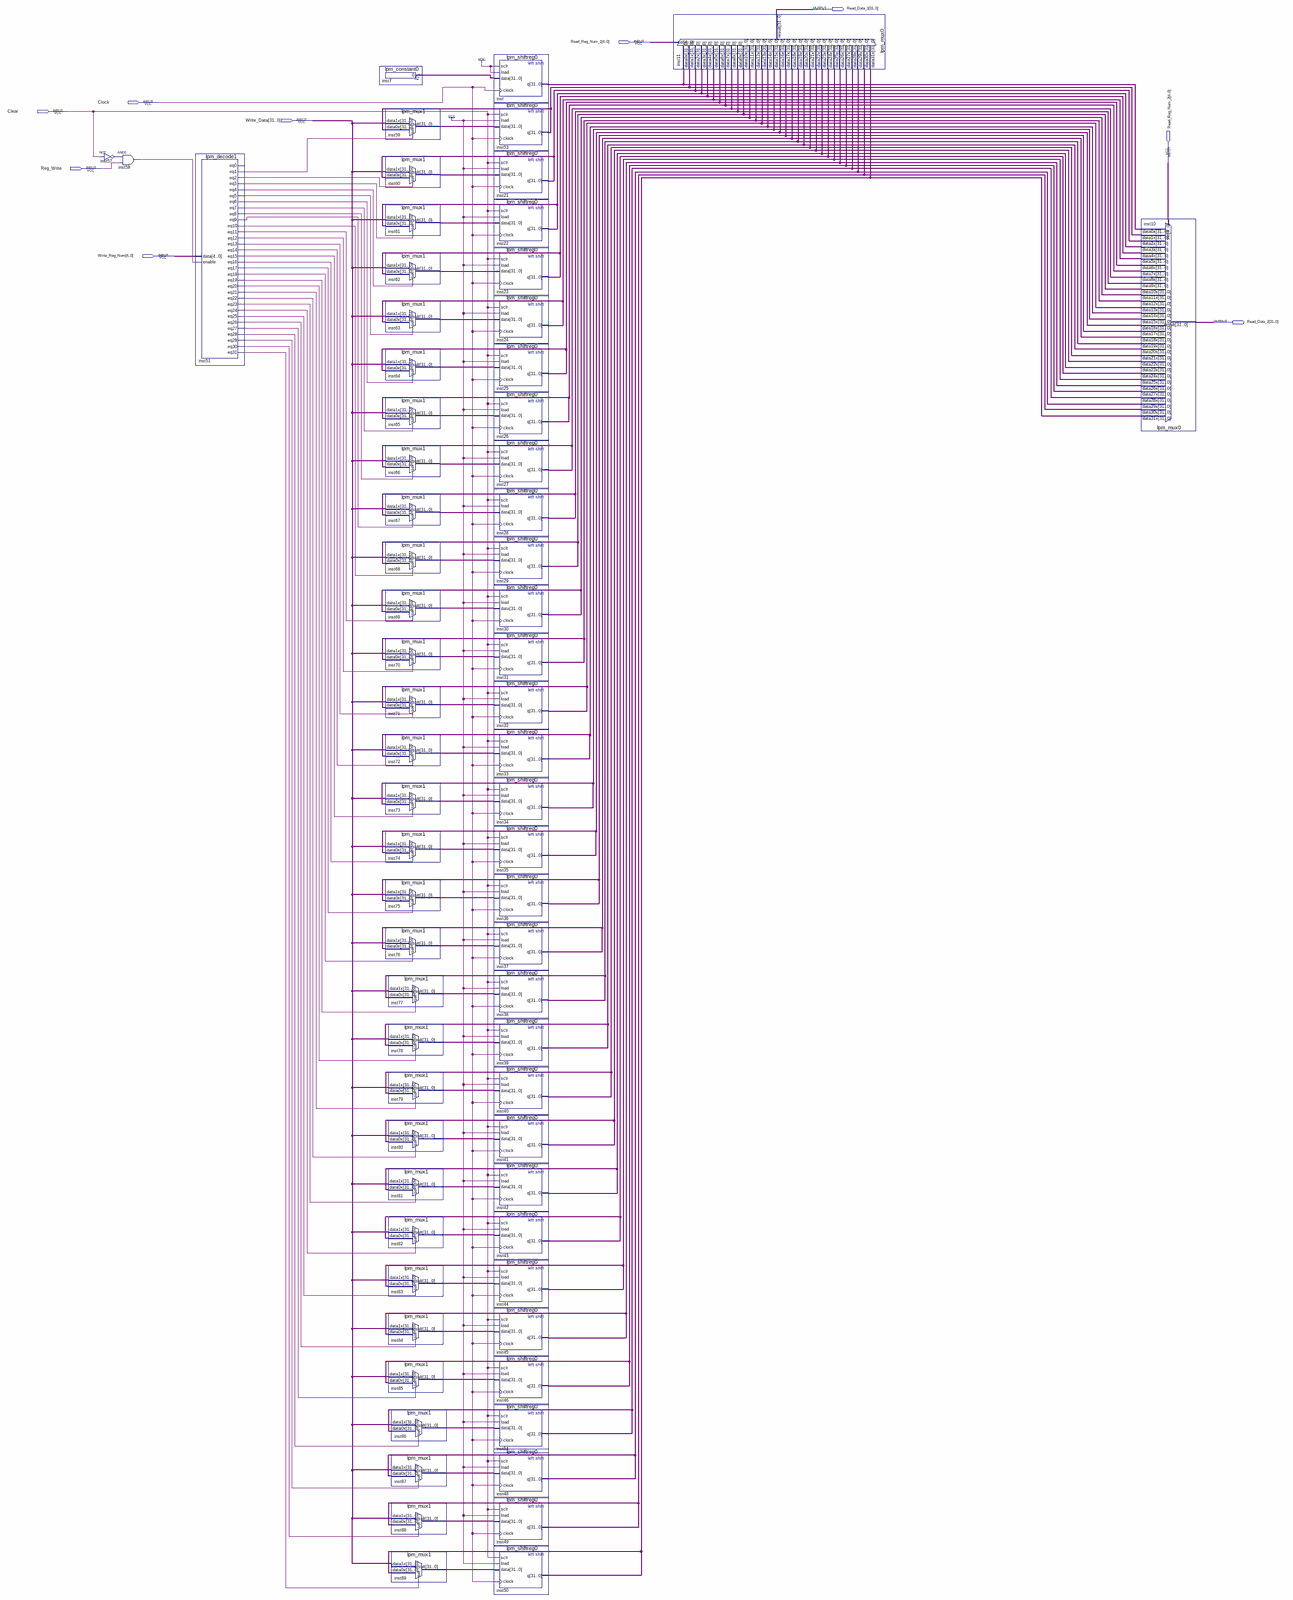
[diagram p0: schematic sheet, whole]
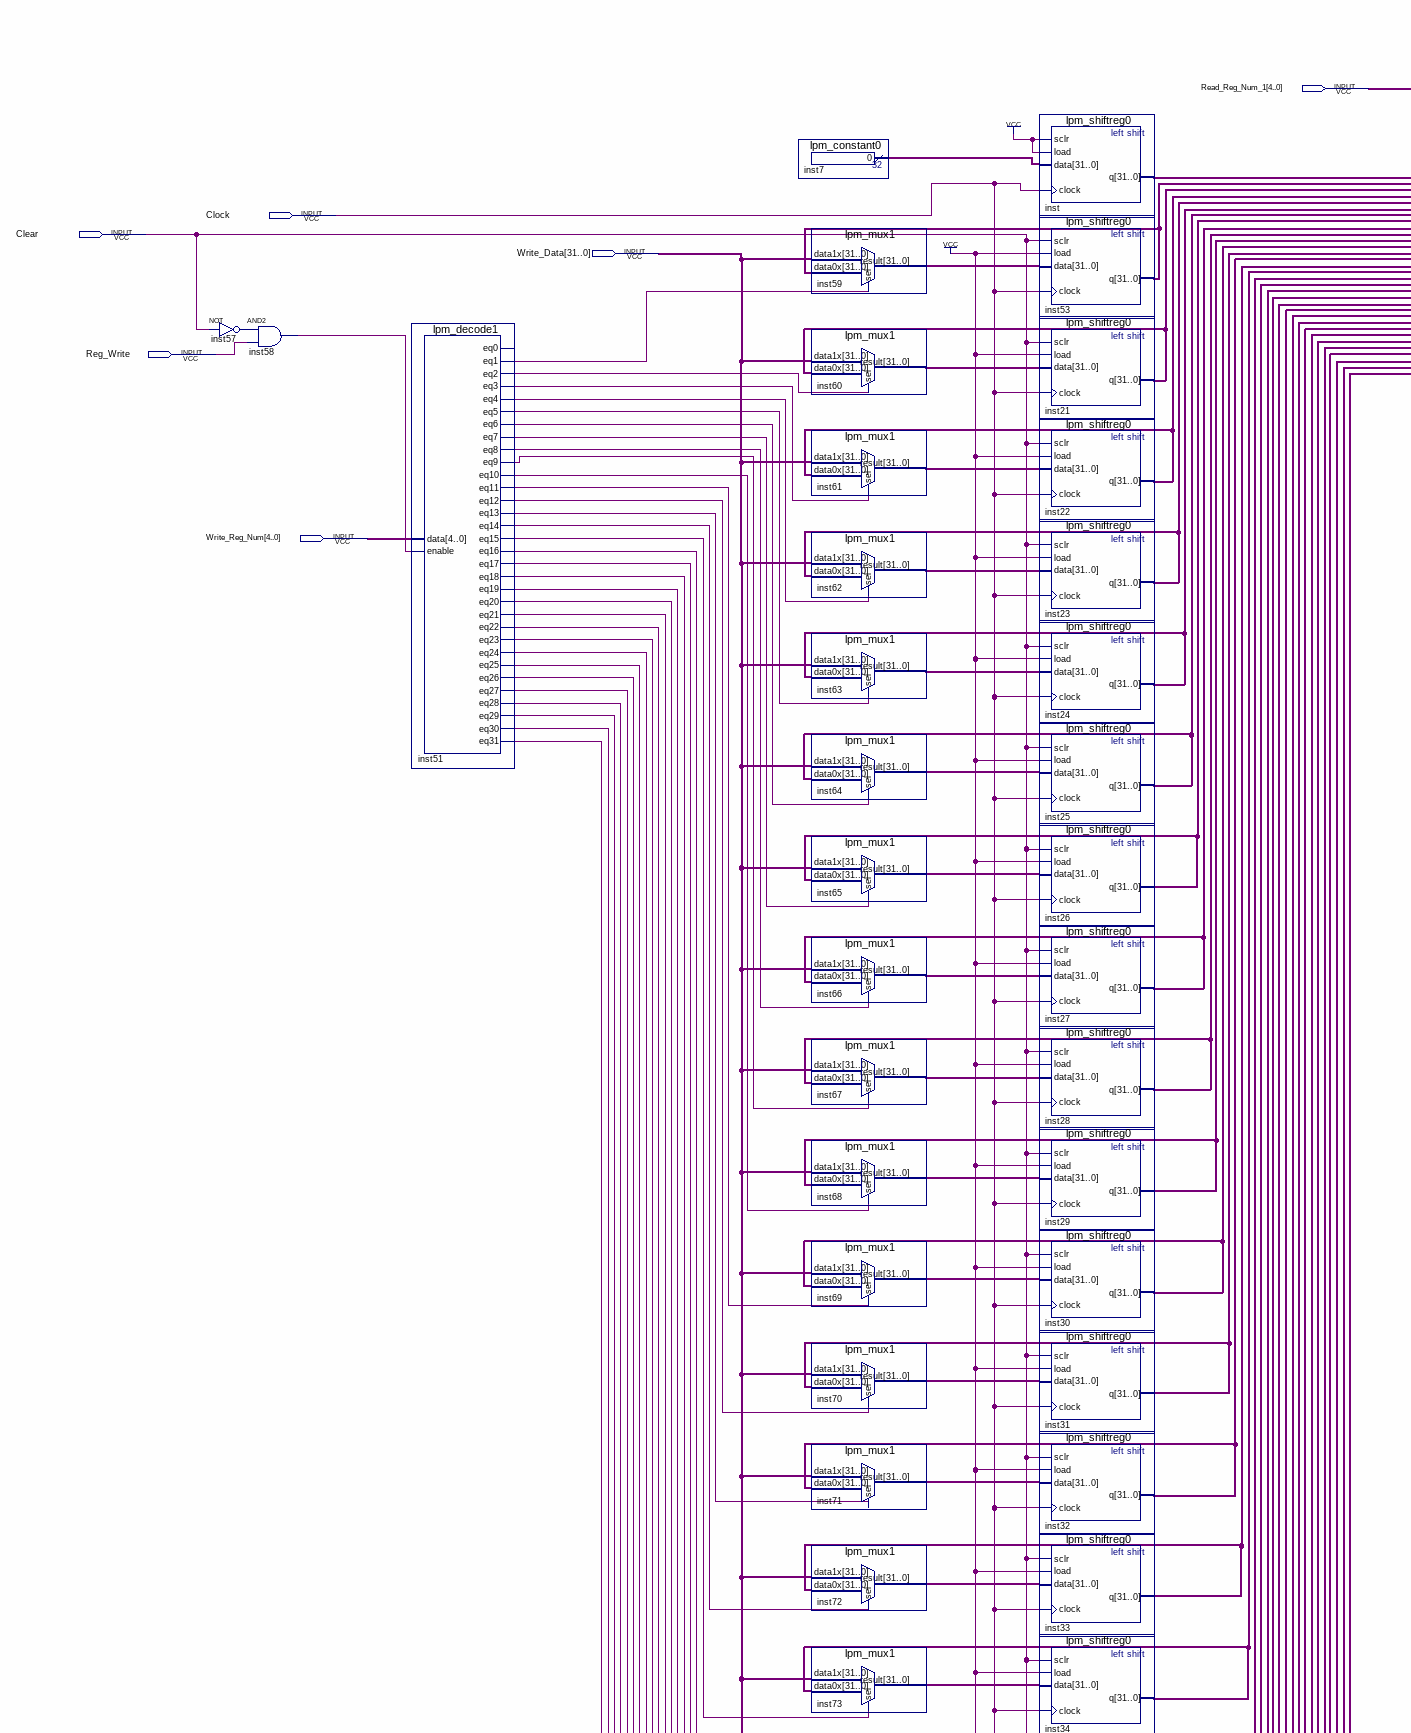
[diagram p1: schematic sheet, upper left part]
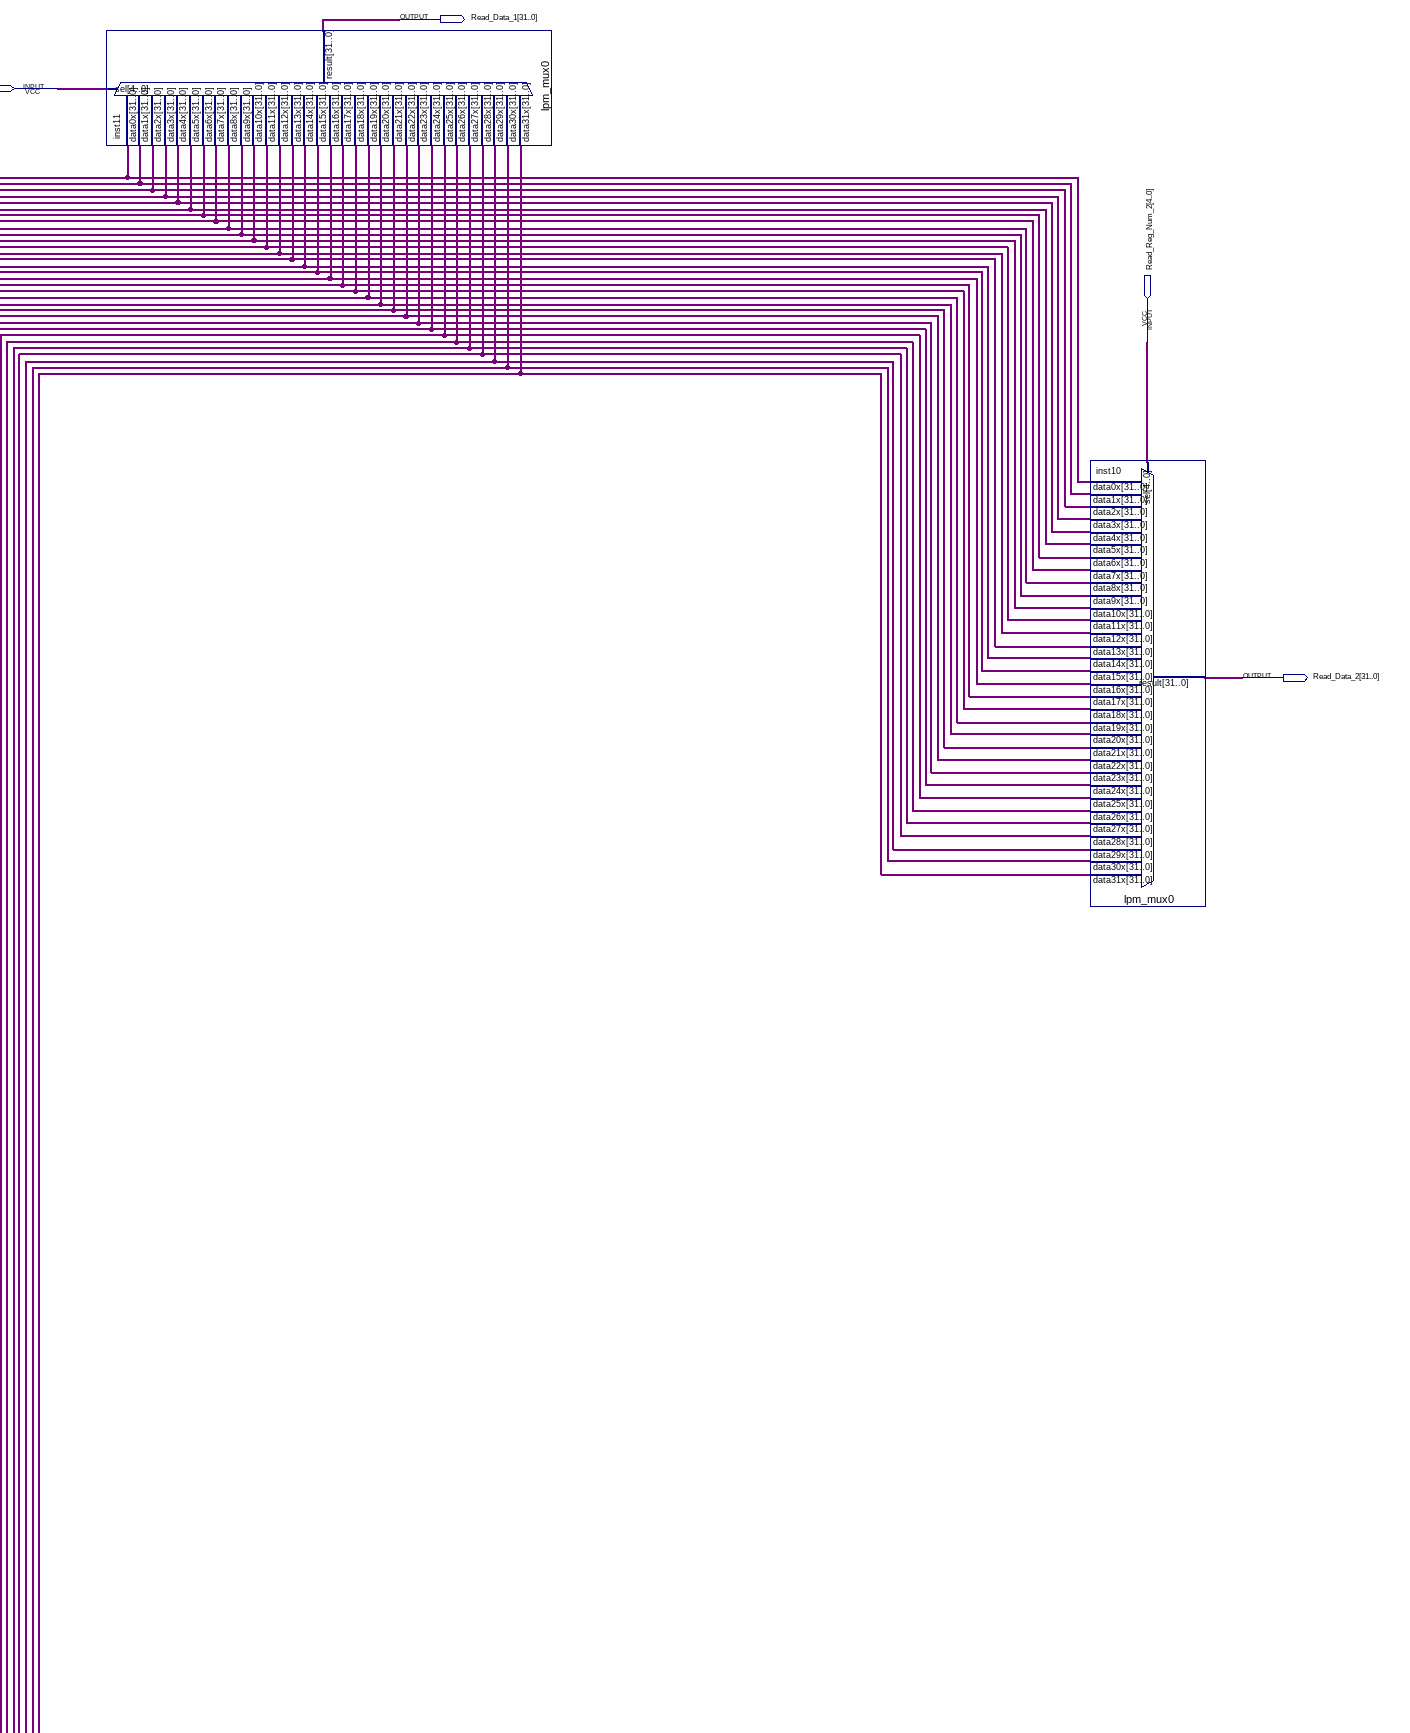
[diagram p2: schematic sheet, upper right part]
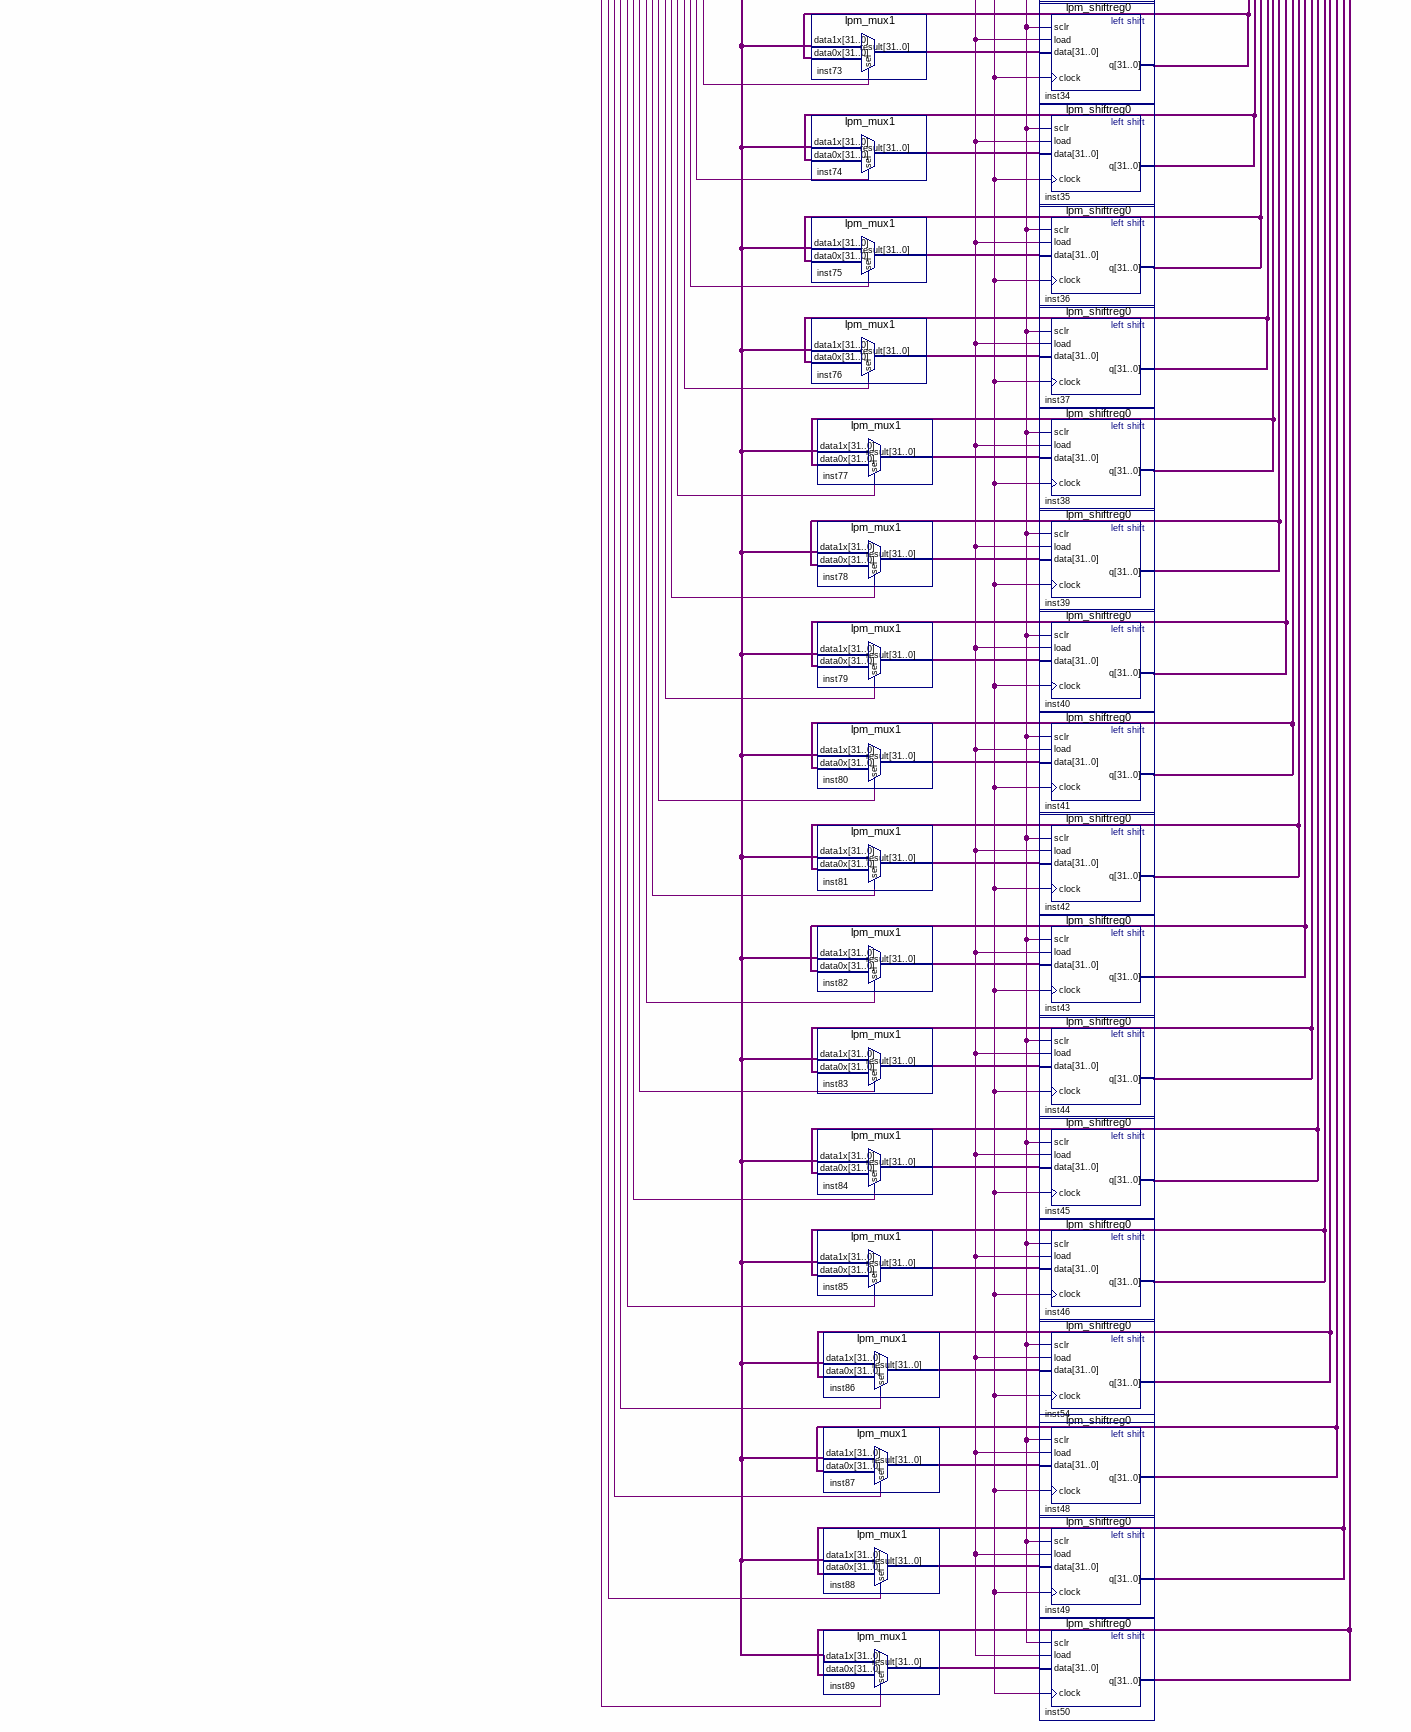
[diagram p3: schematic sheet, lower left part]
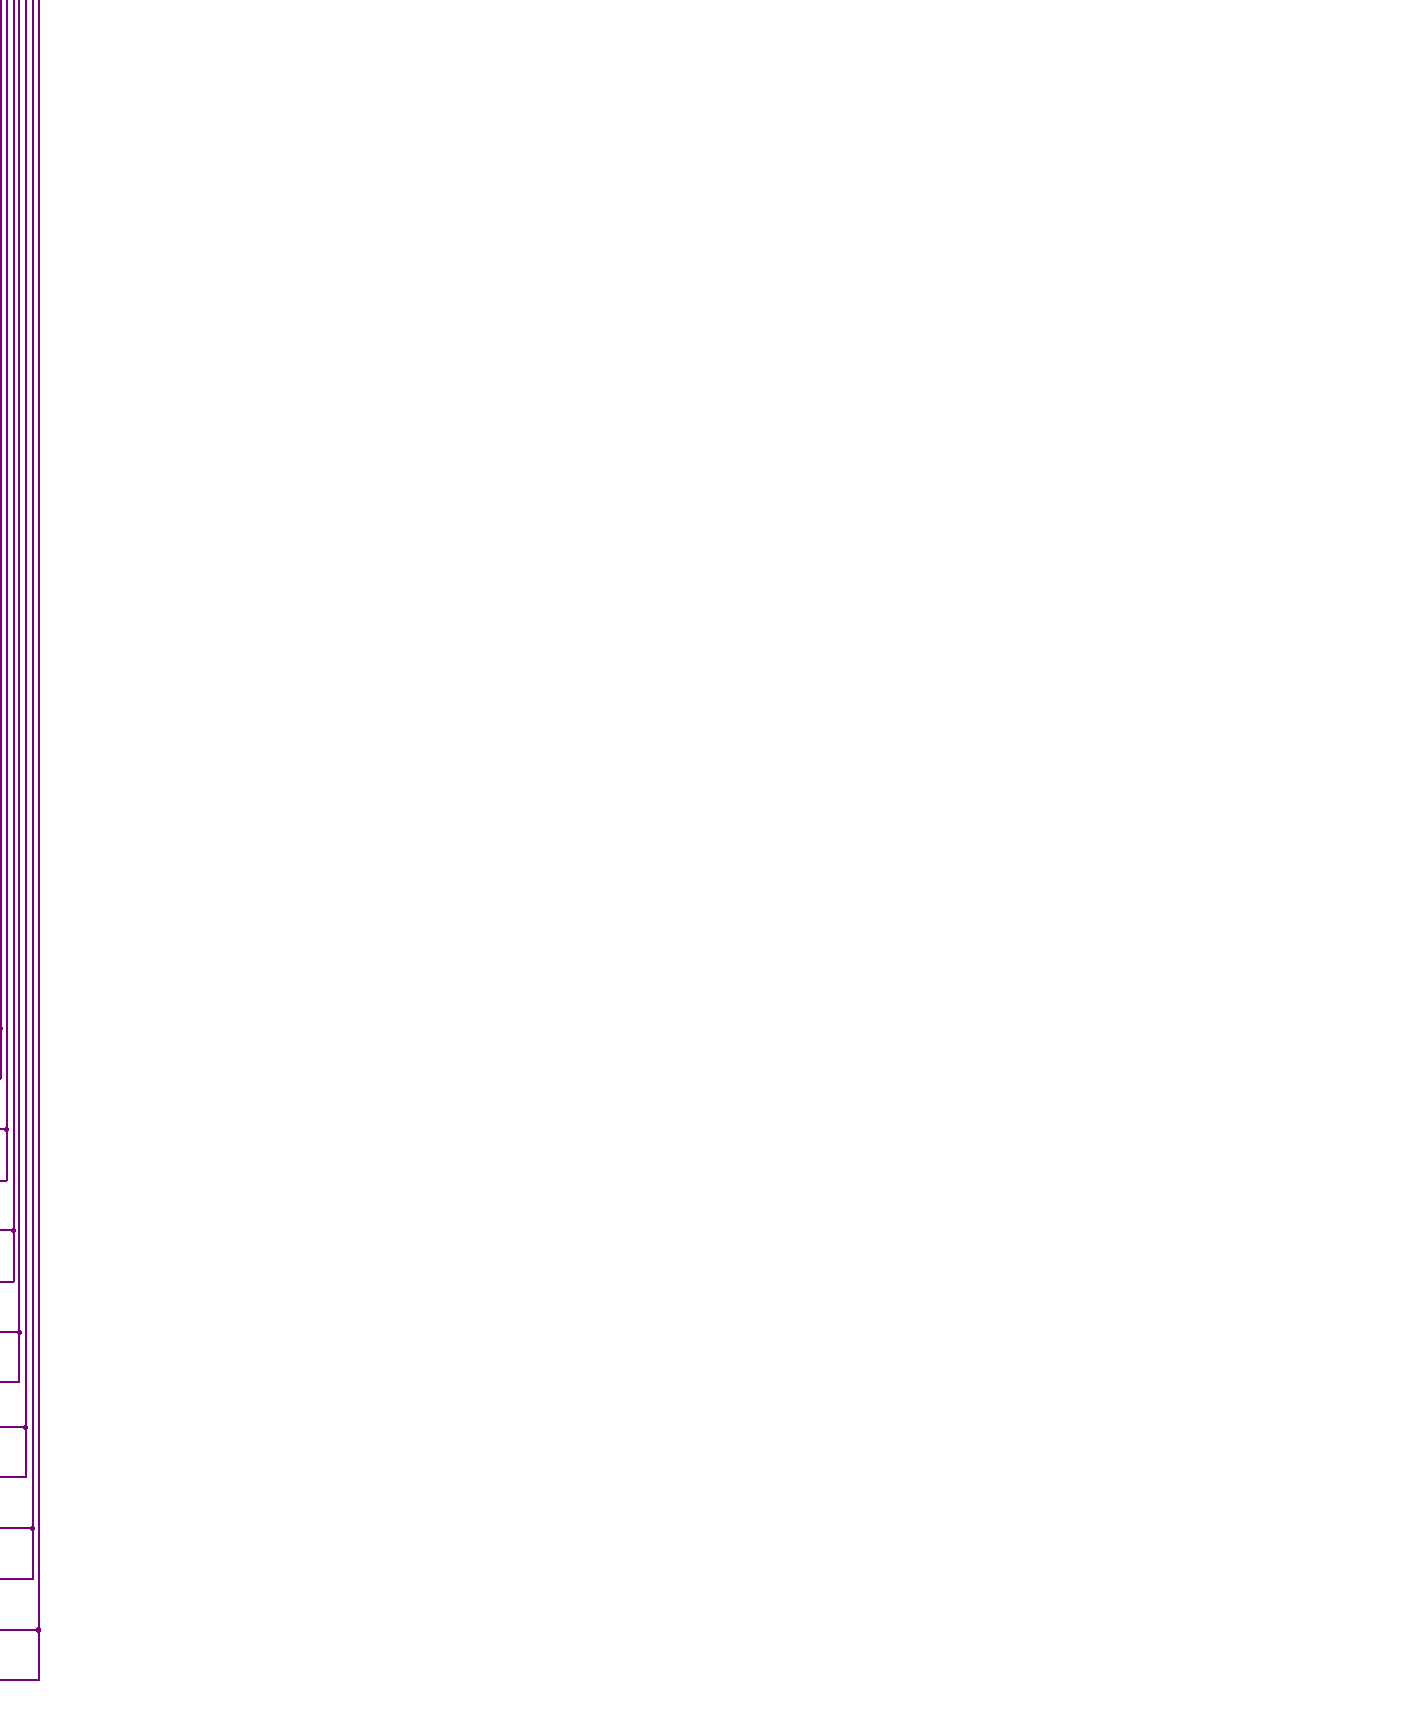
[diagram p4: schematic sheet, lower right part]
// Quartus schematic HW7.bdf as structural Verilog: 69 symbols, 9 pins
module HW7 (
  input  [4:0] Read_Reg_Num_1,
  input  Clock,
  input  Clear,
  input  [31:0] Write_Data,
  input  [4:0] Read_Reg_Num_2,
  input  Reg_Write,
  input  [4:0] Write_Reg_Num,
  output [31:0] Read_Data_1,
  output [31:0] Read_Data_2
);

  wire inst51_eq1, inst51_eq2, inst51_eq3, inst51_eq4, inst51_eq5, inst51_eq6, inst51_eq7, inst51_eq8,
       inst51_eq9, inst51_eq10, inst51_eq11, inst51_eq12, inst51_eq13, inst51_eq14, inst51_eq15, inst51_eq16,
       inst51_eq17, inst51_eq18, inst51_eq19, inst51_eq20, inst51_eq21, inst51_eq22, inst51_eq23,
       inst51_eq24, inst51_eq25, inst51_eq26, inst51_eq27, inst51_eq28, inst51_eq29, inst51_eq30,
       inst51_eq31, inst57_out, inst58_out;
  wire [31:0] inst7_result, inst21_q, inst22_q, inst23_q, inst24_q, inst25_q, inst26_q, inst27_q, inst28_q,
       inst29_q, inst30_q, inst31_q, inst32_q, inst33_q, inst34_q, inst35_q, inst36_q, inst37_q, inst38_q,
       inst39_q, inst40_q, inst41_q, inst42_q, inst43_q, inst44_q, inst45_q, inst46_q, inst48_q, inst49_q,
       inst50_q, inst53_q, inst54_q, inst59_result, inst60_result, inst61_result, inst62_result,
       inst63_result, inst64_result, inst65_result, inst66_result, inst67_result, inst68_result,
       inst69_result, inst70_result, inst71_result, inst72_result, inst73_result, inst74_result,
       inst75_result, inst76_result, inst77_result, inst78_result, inst79_result, inst80_result,
       inst81_result, inst82_result, inst83_result, inst84_result, inst85_result, inst86_result,
       inst87_result, inst88_result, inst89_result, inst_q;

  not inst57 (inst57_out, Clear);
  and inst58 (inst58_out, inst57_out, Reg_Write);
  lpm_decode1 inst51 (
    .data(Write_Reg_Num), .enable(inst58_out), .eq1(inst51_eq1), .eq10(inst51_eq10), .eq11(inst51_eq11),
    .eq12(inst51_eq12), .eq13(inst51_eq13), .eq14(inst51_eq14), .eq15(inst51_eq15), .eq16(inst51_eq16),
    .eq17(inst51_eq17), .eq18(inst51_eq18), .eq19(inst51_eq19), .eq2(inst51_eq2), .eq20(inst51_eq20),
    .eq21(inst51_eq21), .eq22(inst51_eq22), .eq23(inst51_eq23), .eq24(inst51_eq24), .eq25(inst51_eq25),
    .eq26(inst51_eq26), .eq27(inst51_eq27), .eq28(inst51_eq28), .eq29(inst51_eq29), .eq3(inst51_eq3),
    .eq30(inst51_eq30), .eq31(inst51_eq31), .eq4(inst51_eq4), .eq5(inst51_eq5), .eq6(inst51_eq6),
    .eq7(inst51_eq7), .eq8(inst51_eq8), .eq9(inst51_eq9));  // open: eq0
  lpm_constant0 inst7 (.result(inst7_result));
  lpm_mux1 inst59 (.data1x(Write_Data), .data0x(inst53_q), .sel(inst51_eq1), .result(inst59_result));
  lpm_mux1 inst60 (.data1x(Write_Data), .data0x(inst21_q), .sel(inst51_eq2), .result(inst60_result));
  lpm_mux1 inst61 (.data1x(Write_Data), .data0x(inst22_q), .sel(inst51_eq3), .result(inst61_result));
  lpm_mux1 inst62 (.data1x(Write_Data), .data0x(inst23_q), .sel(inst51_eq4), .result(inst62_result));
  lpm_mux1 inst63 (.data1x(Write_Data), .data0x(inst24_q), .sel(inst51_eq5), .result(inst63_result));
  lpm_mux1 inst64 (.data1x(Write_Data), .data0x(inst25_q), .sel(inst51_eq6), .result(inst64_result));
  lpm_mux1 inst65 (.data1x(Write_Data), .data0x(inst26_q), .sel(inst51_eq7), .result(inst65_result));
  lpm_mux1 inst66 (.data1x(Write_Data), .data0x(inst27_q), .sel(inst51_eq8), .result(inst66_result));
  lpm_mux1 inst67 (.data1x(Write_Data), .data0x(inst28_q), .sel(inst51_eq9), .result(inst67_result));
  lpm_mux1 inst68 (.data1x(Write_Data), .data0x(inst29_q), .sel(inst51_eq10), .result(inst68_result));
  lpm_mux1 inst69 (.data1x(Write_Data), .data0x(inst30_q), .sel(inst51_eq11), .result(inst69_result));
  lpm_mux1 inst70 (.data1x(Write_Data), .data0x(inst31_q), .sel(inst51_eq12), .result(inst70_result));
  lpm_mux1 inst71 (.data1x(Write_Data), .data0x(inst32_q), .sel(inst51_eq13), .result(inst71_result));
  lpm_mux1 inst72 (.data1x(Write_Data), .data0x(inst33_q), .sel(inst51_eq14), .result(inst72_result));
  lpm_mux1 inst73 (.data1x(Write_Data), .data0x(inst34_q), .sel(inst51_eq15), .result(inst73_result));
  lpm_mux1 inst74 (.data1x(Write_Data), .data0x(inst35_q), .sel(inst51_eq16), .result(inst74_result));
  lpm_mux1 inst75 (.data1x(Write_Data), .data0x(inst36_q), .sel(inst51_eq17), .result(inst75_result));
  lpm_mux1 inst76 (.data1x(Write_Data), .data0x(inst37_q), .sel(inst51_eq18), .result(inst76_result));
  lpm_mux1 inst77 (.data1x(Write_Data), .data0x(inst38_q), .sel(inst51_eq19), .result(inst77_result));
  lpm_mux1 inst78 (.data1x(Write_Data), .data0x(inst39_q), .sel(inst51_eq20), .result(inst78_result));
  lpm_mux1 inst79 (.data1x(Write_Data), .data0x(inst40_q), .sel(inst51_eq21), .result(inst79_result));
  lpm_mux1 inst80 (.data1x(Write_Data), .data0x(inst41_q), .sel(inst51_eq22), .result(inst80_result));
  lpm_mux1 inst81 (.data1x(Write_Data), .data0x(inst42_q), .sel(inst51_eq23), .result(inst81_result));
  lpm_mux1 inst82 (.data1x(Write_Data), .data0x(inst43_q), .sel(inst51_eq24), .result(inst82_result));
  lpm_mux1 inst83 (.data1x(Write_Data), .data0x(inst44_q), .sel(inst51_eq25), .result(inst83_result));
  lpm_mux1 inst84 (.data1x(Write_Data), .data0x(inst45_q), .sel(inst51_eq26), .result(inst84_result));
  lpm_mux1 inst85 (.data1x(Write_Data), .data0x(inst46_q), .sel(inst51_eq27), .result(inst85_result));
  lpm_mux1 inst86 (.data1x(Write_Data), .data0x(inst54_q), .sel(inst51_eq28), .result(inst86_result));
  lpm_mux1 inst87 (.data1x(Write_Data), .data0x(inst48_q), .sel(inst51_eq29), .result(inst87_result));
  lpm_mux1 inst88 (.data1x(Write_Data), .data0x(inst49_q), .sel(inst51_eq30), .result(inst88_result));
  lpm_mux1 inst89 (.data1x(Write_Data), .data0x(inst50_q), .sel(inst51_eq31), .result(inst89_result));
  lpm_shiftreg0 inst (.sclr(1'b1), .load(1'b1), .data(inst7_result), .clock(Clock), .q(inst_q));
  lpm_shiftreg0 inst53 (.clock(Clock), .data(inst59_result), .load(1'b1), .sclr(Clear), .q(inst53_q));
  lpm_shiftreg0 inst21 (.sclr(Clear), .load(1'b1), .data(inst60_result), .clock(Clock), .q(inst21_q));
  lpm_shiftreg0 inst22 (.sclr(Clear), .load(1'b1), .data(inst61_result), .clock(Clock), .q(inst22_q));
  lpm_shiftreg0 inst23 (.sclr(Clear), .load(1'b1), .data(inst62_result), .clock(Clock), .q(inst23_q));
  lpm_shiftreg0 inst24 (.sclr(Clear), .load(1'b1), .data(inst63_result), .clock(Clock), .q(inst24_q));
  lpm_shiftreg0 inst25 (.sclr(Clear), .load(1'b1), .data(inst64_result), .clock(Clock), .q(inst25_q));
  lpm_shiftreg0 inst26 (.sclr(Clear), .load(1'b1), .data(inst65_result), .clock(Clock), .q(inst26_q));
  lpm_shiftreg0 inst27 (.sclr(Clear), .load(1'b1), .data(inst66_result), .clock(Clock), .q(inst27_q));
  lpm_shiftreg0 inst28 (.sclr(Clear), .load(1'b1), .data(inst67_result), .clock(Clock), .q(inst28_q));
  lpm_shiftreg0 inst29 (.sclr(Clear), .load(1'b1), .data(inst68_result), .clock(Clock), .q(inst29_q));
  lpm_shiftreg0 inst30 (.sclr(Clear), .load(1'b1), .data(inst69_result), .clock(Clock), .q(inst30_q));
  lpm_shiftreg0 inst31 (.sclr(Clear), .load(1'b1), .data(inst70_result), .clock(Clock), .q(inst31_q));
  lpm_shiftreg0 inst32 (.sclr(Clear), .load(1'b1), .data(inst71_result), .clock(Clock), .q(inst32_q));
  lpm_shiftreg0 inst33 (.sclr(Clear), .load(1'b1), .data(inst72_result), .clock(Clock), .q(inst33_q));
  lpm_shiftreg0 inst34 (.sclr(Clear), .load(1'b1), .data(inst73_result), .clock(Clock), .q(inst34_q));
  lpm_shiftreg0 inst35 (.sclr(Clear), .load(1'b1), .data(inst74_result), .clock(Clock), .q(inst35_q));
  lpm_shiftreg0 inst36 (.sclr(Clear), .load(1'b1), .data(inst75_result), .clock(Clock), .q(inst36_q));
  lpm_shiftreg0 inst37 (.sclr(Clear), .load(1'b1), .data(inst76_result), .clock(Clock), .q(inst37_q));
  lpm_shiftreg0 inst38 (.sclr(Clear), .load(1'b1), .data(inst77_result), .clock(Clock), .q(inst38_q));
  lpm_shiftreg0 inst39 (.sclr(Clear), .load(1'b1), .data(inst78_result), .clock(Clock), .q(inst39_q));
  lpm_shiftreg0 inst40 (.sclr(Clear), .load(1'b1), .data(inst79_result), .clock(Clock), .q(inst40_q));
  lpm_shiftreg0 inst41 (.sclr(Clear), .load(1'b1), .data(inst80_result), .clock(Clock), .q(inst41_q));
  lpm_shiftreg0 inst42 (.sclr(Clear), .load(1'b1), .data(inst81_result), .clock(Clock), .q(inst42_q));
  lpm_shiftreg0 inst43 (.sclr(Clear), .load(1'b1), .data(inst82_result), .clock(Clock), .q(inst43_q));
  lpm_shiftreg0 inst44 (.sclr(Clear), .load(1'b1), .data(inst83_result), .clock(Clock), .q(inst44_q));
  lpm_shiftreg0 inst45 (.sclr(Clear), .load(1'b1), .data(inst84_result), .clock(Clock), .q(inst45_q));
  lpm_shiftreg0 inst46 (.sclr(Clear), .load(1'b1), .data(inst85_result), .clock(Clock), .q(inst46_q));
  lpm_shiftreg0 inst54 (.sclr(Clear), .load(1'b1), .data(inst86_result), .clock(Clock), .q(inst54_q));
  lpm_shiftreg0 inst48 (.sclr(Clear), .load(1'b1), .data(inst87_result), .clock(Clock), .q(inst48_q));
  lpm_shiftreg0 inst49 (.sclr(Clear), .load(1'b1), .data(inst88_result), .clock(Clock), .q(inst49_q));
  lpm_shiftreg0 inst50 (.sclr(Clear), .load(1'b1), .data(inst89_result), .clock(Clock), .q(inst50_q));
  lpm_mux0 inst11 (
    .data31x(inst50_q), .data30x(inst49_q), .data29x(inst48_q), .data28x(inst54_q), .data27x(inst46_q),
    .data26x(inst45_q), .data25x(inst44_q), .data24x(inst43_q), .data23x(inst42_q), .data22x(inst41_q),
    .data21x(inst40_q), .data20x(inst39_q), .data19x(inst38_q), .data18x(inst37_q), .data17x(inst36_q),
    .data16x(inst35_q), .data15x(inst34_q), .data14x(inst33_q), .data13x(inst32_q), .data12x(inst31_q),
    .data11x(inst30_q), .data10x(inst29_q), .data9x(inst28_q), .data8x(inst27_q), .data7x(inst26_q),
    .data6x(inst25_q), .data5x(inst24_q), .data4x(inst23_q), .data3x(inst22_q), .data2x(inst21_q),
    .data1x(inst53_q), .data0x(inst_q), .sel(Read_Reg_Num_1), .result(Read_Data_1));
  lpm_mux0 inst10 (
    .data31x(inst50_q), .data30x(inst49_q), .data29x(inst48_q), .data28x(inst54_q), .data27x(inst46_q),
    .data26x(inst45_q), .data25x(inst44_q), .data24x(inst43_q), .data23x(inst42_q), .data22x(inst41_q),
    .data21x(inst40_q), .data20x(inst39_q), .data19x(inst38_q), .data18x(inst37_q), .data17x(inst36_q),
    .data16x(inst35_q), .data15x(inst34_q), .data14x(inst33_q), .data13x(inst32_q), .data12x(inst31_q),
    .data11x(inst30_q), .data10x(inst29_q), .data9x(inst28_q), .data8x(inst27_q), .data7x(inst26_q),
    .data6x(inst25_q), .data5x(inst24_q), .data4x(inst23_q), .data3x(inst22_q), .data2x(inst21_q),
    .data1x(inst53_q), .data0x(inst_q), .sel(Read_Reg_Num_2), .result(Read_Data_2));
endmodule
